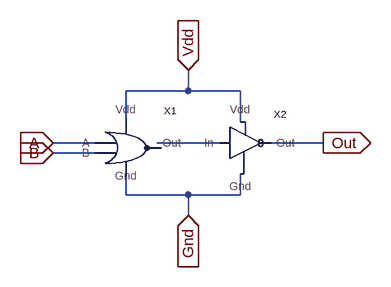
[diagram p0: schematic OR.asc]
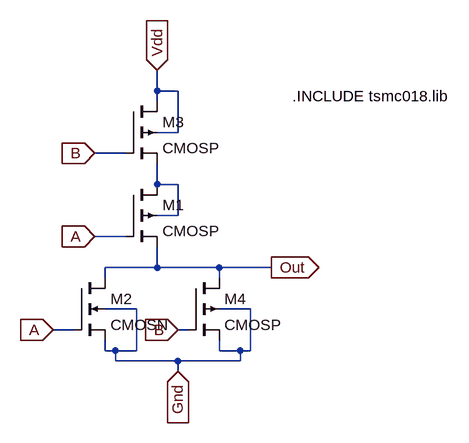
[diagram p1: sub-circuit nor.asc]
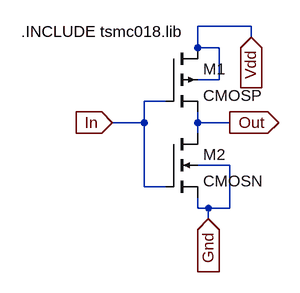
[diagram p2: sub-circuit not.asc]
OR.asc, the LTspice schematic file:
Version 4
SHEET 1 880 680
WIRE 176 80 176 48
WIRE 176 80 80 80
WIRE 256 80 176 80
WIRE 80 128 80 80
WIRE 256 128 256 80
WIRE 32 160 -32 160
WIRE 224 160 128 160
WIRE 384 160 304 160
WIRE 32 176 -32 176
WIRE 80 240 80 192
WIRE 176 240 80 240
WIRE 256 240 256 208
WIRE 256 240 176 240
WIRE 176 272 176 240
FLAG -32 160 A
IOPIN -32 160 In
FLAG -32 176 B
IOPIN -32 176 In
FLAG 176 272 Gnd
IOPIN 176 272 In
FLAG 176 48 Vdd
IOPIN 176 48 In
FLAG 384 160 Out
IOPIN 384 160 Out
SYMBOL NOR 80 192 R0
SYMATTR InstName X1
SYMBOL NOT 288 192 R0
SYMATTR InstName X2

nor.asc, the sub-circuit schematic file:
Version 4
SHEET 1 880 680
WIRE 144 -80 144 -112
WIRE 176 -80 144 -80
WIRE 144 -64 144 -80
WIRE 176 -16 176 -80
WIRE 176 -16 144 -16
WIRE 96 16 48 16
WIRE 144 64 144 32
WIRE 176 64 144 64
WIRE 176 112 176 64
WIRE 176 112 144 112
WIRE 96 144 48 144
WIRE 144 192 144 160
WIRE 144 192 64 192
WIRE 240 192 144 192
WIRE 320 192 240 192
WIRE 64 208 64 192
WIRE 240 208 240 192
WIRE 112 256 64 256
WIRE 288 256 240 256
WIRE 16 288 -16 288
WIRE 192 288 176 288
WIRE 64 320 64 304
WIRE 80 320 64 320
WIRE 112 320 112 256
WIRE 112 320 80 320
WIRE 240 320 240 304
WIRE 272 320 240 320
WIRE 288 320 288 256
WIRE 288 320 272 320
WIRE 80 336 80 320
WIRE 176 336 80 336
WIRE 272 336 272 320
WIRE 272 336 176 336
WIRE 176 352 176 336
FLAG 176 352 Gnd
IOPIN 176 352 In
FLAG -16 288 A
IOPIN -16 288 In
FLAG 48 144 A
IOPIN 48 144 In
FLAG 176 288 B
IOPIN 176 288 In
FLAG 48 16 B
IOPIN 48 16 In
FLAG 320 192 Out
IOPIN 320 192 Out
FLAG 144 -112 Vdd
IOPIN 144 -112 In
SYMBOL cmosp 96 64 R0
SYMATTR InstName M1
SYMATTR Value2 l=180n w=1600n
SYMBOL cmosn 16 208 R0
SYMATTR InstName M2
SYMATTR Value2 l=180n w=400n
SYMBOL cmosp 96 -64 R0
SYMATTR InstName M3
SYMATTR Value2 l=180n w=1600n
SYMBOL cmosp 192 208 R0
SYMATTR InstName M4
SYMATTR Value2 l=180n w=400n
TEXT 352 -72 Left 2 !.INCLUDE tsmc018.lib

not.asc, the sub-circuit schematic file:
Version 4
SHEET 1 880 680
WIRE 224 32 144 32
WIRE 224 48 224 32
WIRE 144 64 144 32
WIRE 176 64 144 64
WIRE 176 112 176 64
WIRE 176 112 144 112
WIRE 96 144 64 144
WIRE 64 176 64 144
WIRE 64 176 16 176
WIRE 144 176 144 160
WIRE 192 176 144 176
WIRE 144 192 144 176
WIRE 192 240 144 240
WIRE 64 272 64 176
WIRE 96 272 64 272
WIRE 144 304 144 288
WIRE 160 304 144 304
WIRE 192 304 192 240
WIRE 192 304 160 304
WIRE 160 320 160 304
FLAG 160 320 Gnd
IOPIN 160 320 In
FLAG 192 176 Out
IOPIN 192 176 Out
FLAG 224 48 Vdd
IOPIN 224 48 In
FLAG 16 176 In
IOPIN 16 176 In
SYMBOL cmosp 96 64 R0
SYMATTR InstName M1
SYMATTR Value2 l=180n w=800n
SYMBOL cmosn 96 192 R0
SYMATTR InstName M2
SYMATTR Value2 l=180n w=400n
TEXT -120 40 Left 2 !.INCLUDE tsmc018.lib

The netlist it stands for:
* OR.asc
XX1 A B Vdd Gnd N001 nor
XX2 N001 Out Vdd Gnd not

* block symbol definitions
.subckt nor A B Vdd Gnd Out
M1 N001 A Out N001 CMOSP l=180n w=1600n
M2 Out A Gnd Gnd CMOSN l=180n w=400n
M3 Vdd B N001 Vdd CMOSP l=180n w=1600n
M4 Out B Gnd Gnd CMOSP l=180n w=400n
.INCLUDE tsmc018.lib
.ends nor

.subckt not In Out Vdd Gnd
M1 Vdd In Out Vdd CMOSP l=180n w=800n
M2 Out In Gnd Gnd CMOSN l=180n w=400n
.INCLUDE tsmc018.lib
.ends not

.model NMOS NMOS
.model PMOS PMOS
.lib standard.mos
.backanno
.end